# Altium schematic sheet XTJ-Prime_2S1P.SchDoc: XTJ-Prime_2S2P
size Letter; Author: Nicholas J. Sorensen, and Erik F. Halliwell; Engineer: Nicholas Sorensen, and Erik Halliwell; DocumentNumber: 6; SheetNumber: 6; SheetTotal: 8
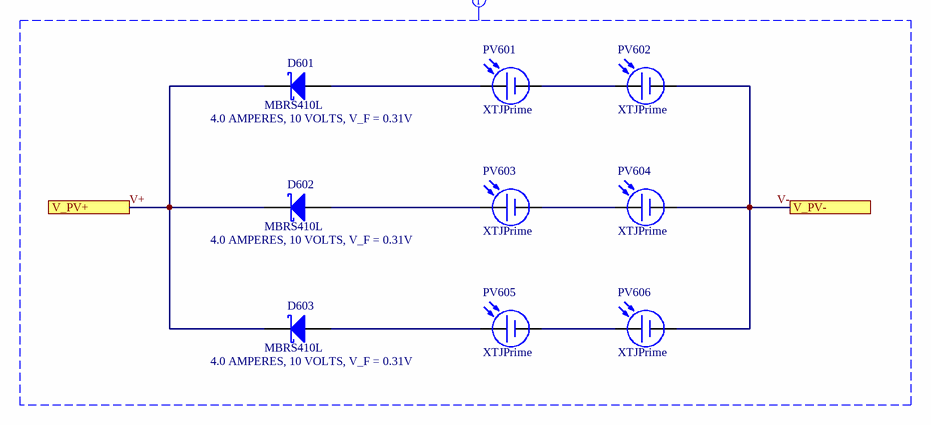
[diagram p0: XTJ-Prime_2S1P.SchDoc]

## Parts
D601  MBRS410L  [ONS-875]
D602  MBRS410L  [ONS-875]
D603  MBRS410L  [ONS-875]
PV601  XTJPrime  [XTJ Prime]
PV602  XTJPrime  [XTJ Prime]
PV603  XTJPrime  [XTJ Prime]
PV604  XTJPrime  [XTJ Prime]
PV605  XTJPrime  [XTJ Prime]
PV606  XTJPrime  [XTJ Prime]

## Ports
V_PV+, V_PV-

## Nets
V+: D601.2 D602.2 D603.2 ; port V_PV+
V-: PV602.2(Neg) PV604.2(Neg) PV606.2(Neg) ; port V_PV-
NetD601_1: D601.1 PV601.1(Pos)
NetD602_1: D602.1 PV603.1(Pos)
NetD603_1: D603.1 PV605.1(Pos)
NetPV601_2: PV601.2(Neg) PV602.1(Pos)
NetPV603_2: PV603.2(Neg) PV604.1(Pos)
NetPV605_2: PV605.2(Neg) PV606.1(Pos)

## Layout directives
mark named Photovoltaic Array: V+, V-

## Notes on the sheet
- (near D601) 4.0 AMPERES, 10 VOLTS, V_F = 0.31V
- (near D602) 4.0 AMPERES, 10 VOLTS, V_F = 0.31V
- (near D603) 4.0 AMPERES, 10 VOLTS, V_F = 0.31V
- (the "License"); you may not use or redistribute this file except in compliance with the License. You
- This file and the information within it are licensed under the terms of the Apache License, Version 2.0
- Copyright
- Unless required by applicable law or agreed to in writing, content distributed under the License is
- distributed on an "AS IS" BASIS, WITHOUT WARRANTIES OR CONDITIONS OF ANY KIND,
- either express or implied. See the License for the specific language governing permissions and
- limitations under the License.
- may obtain a copy of the License at:
- http://www.apache.org/licenses/LICENSE-2.0
- Title
- Size:
- Date:
- Letter
- Number:
- Time:
- Revision:
- Sheet
- of
- University of Alberta
- Deptartment of Electrical
- and Computer Engineering
- Edmonton AB, Canada
- T6G 1H9
- File:

## Library data of the parts
D601-D603 = PXX-ONS-00003: SCHOTTKY BARRIER / RECTIFIERS / 4.0 AMPERES, 10 VOLTS, V_F = 0.31V; Index: 3; Designator: U?; Published: 1/18/2020; LatestRevisionDate: 1/18/2020; LatestRevisionNote: ...; PackageReference: SMB; Publisher: AlbertaSat; PackageDescription: DO-214-AA/SMB; 2 C-Bend Leads; Body 5.3 x 3.6 mm, inc. leads (LxW); Code_JEDEC: DO-214-AA; Part Number: PXX-ONS-00003; Manufacturer Part Number: MBRS410L; Supplier Part Number 1: MBRS410LT3-D; Supplier 1: Digi-key; Supplier Link: #https://www.digikey.com/product-detail/en/on-semiconductor/MBRS410LT3G/MBRS410LT3GOSCT-ND/1967073#
PV601-PV606 = PBT-SPEC-00002: Manufacturer Part Number: Spectrolab; Index: 2; Part Number: PBT-SPEC-00002; Supplier Part Number 1: UTJ CIC 26.26cm^2; Supplier 1: Spectrolab; Publisher: AlbertaSat; LatestRevisionNote: ...; PackageReference: 3-Connector Solar Cell